# EAGLE design Display (EAGLE 7.3.0)
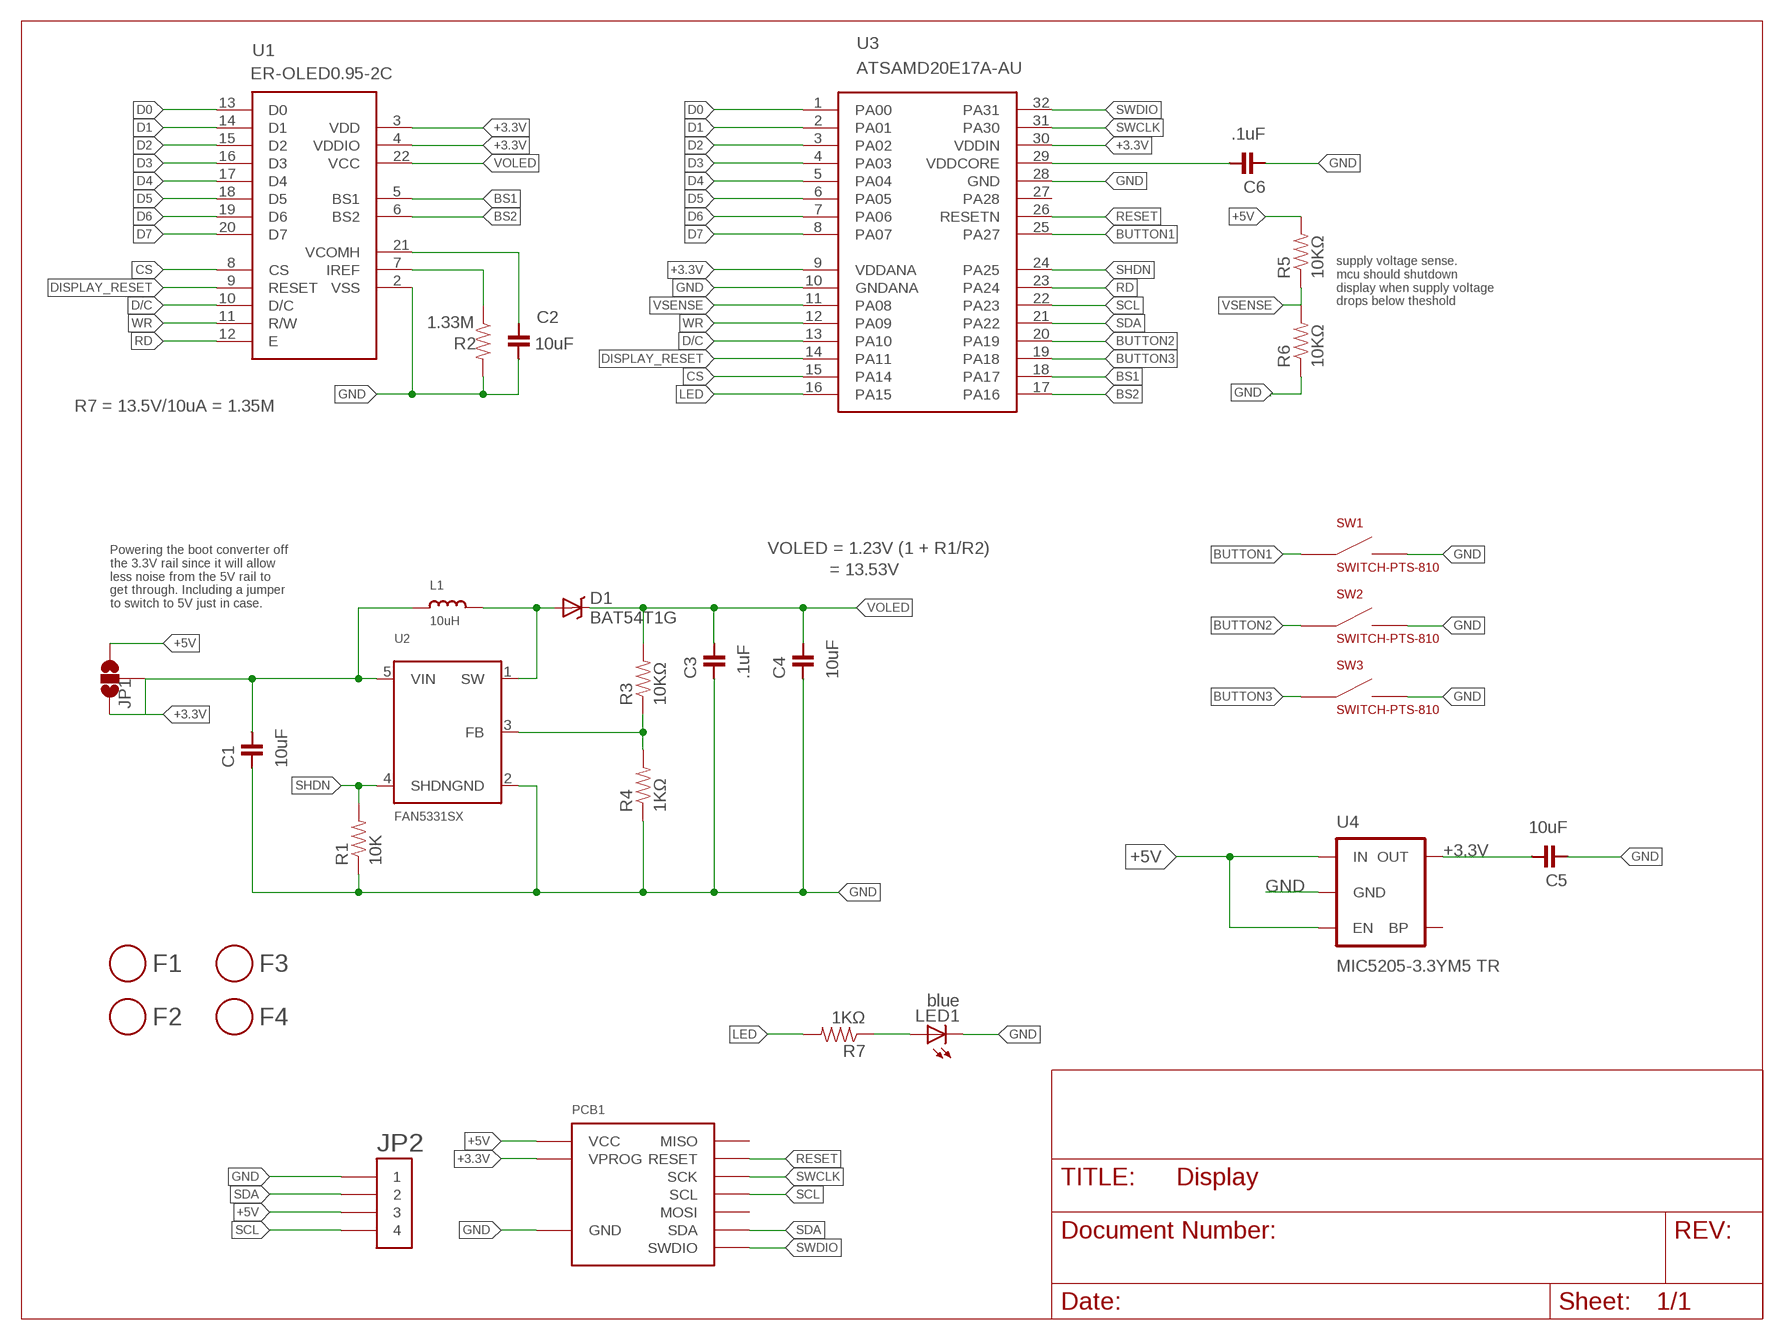
[diagram p0: schematic, sheet 1]
FRAME1 (LETTER_L): BOM: EXCLUDE

## Parts
C1  10uF  CAPACITOR-10UF  [0603]
C2  10uF  CAPACITOR-10UF  [0603]
C3  .1uF  CAPACITOR-.1UF  [0603]
C4  10uF  CAPACITOR-10UF  [0603]
C5  10uF  CAPACITOR-10UF  [0603]
C6  .1uF  CAPACITOR-.1UF  [0603]
D1  BAT54T1G  DIODE-SCHOTTKY  [SMP]
F1  FIDUCIAL  [FIDUCIAL_1MM]
F2  FIDUCIAL  [FIDUCIAL_1MM]
F3  FIDUCIAL  [FIDUCIAL_1MM]
F4  FIDUCIAL  [FIDUCIAL_1MM]
JP1  SOLDERJUMPER_2WAYS  [SJ_3]
JP2  HEADER-1X4-AMPMODU  [AMPMODU-4P]
L1  10uH  INDUCTOR  [INDUCTOR_1007]
LED1  blue  LED-0805-BLUE  [0805-LED]
PCB1  DEVICE-PCB  [DEVICE-PCB]
R1  10K  RESISTOR-10KΩ  [0603]
R2  1.33M  RESISTOR-0603  [0603]
R3  10KΩ  RESISTOR-10KΩ  [0603]
R4  1KΩ  RESISTOR-1KΩ  [0603]
R5  10KΩ  RESISTOR-10KΩ  [0603]
R6  10KΩ  RESISTOR-10KΩ  [0603]
R7  1KΩ  RESISTOR-1KΩ  [0603]
SW1  SWITCH-PTS-810  [TACT-SWITCH-PTS-810]
SW2  SWITCH-PTS-810  [TACT-SWITCH-PTS-810]
SW3  SWITCH-PTS-810  [TACT-SWITCH-PTS-810]
U1  ER-OLED0.95-2C  OLED-COLORREVERSE  [FPC-24-REVERSE]
U2  FAN5331SX  FAN5331  [SOT23-5]
U3  ATSAMD20E17A-AU  SAMD21E  [TQFP-32]
U4  MIC5205-3.3YM5 TR  VREG-MIC5205-3.3V  [SOT23-5]

## Nets
+3.3V: C1.1 C5.1 JP1.1 JP1.2 L1.P$1 PCB1.VPROG U1.3(VDD) U1.4(VDDIO) U2.5(VIN) U3.9(VDDANA) U3.30(VDDIN) U4.5(OUT)
+5V: JP1.3 JP2.P$5 JP2.P$6 PCB1.VCC R5.2 U4.1(IN) U4.3(EN)
BS1: U1.5(BS1) U3.18(PA17)
BS2: U1.6(BS2) U3.17(PA16)
BUTTON1: SW1.P$1(POS1) SW1.P$2(POS1) U3.25(PA27)
BUTTON2: SW2.P$1(POS1) SW2.P$2(POS1) U3.20(PA19)
BUTTON3: SW3.P$1(POS1) SW3.P$2(POS1) U3.19(PA18)
CS: U1.8(CS) U3.15(PA14)
D0: U1.13(D0) U3.1(PA00)
D1: U1.14(D1) U3.2(PA01)
D2: U1.15(D2) U3.3(PA02)
D3: U1.16(D3) U3.4(PA03)
D4: U1.17(D4) U3.5(PA04)
D5: U1.18(D5) U3.6(PA05)
D6: U1.19(D6) U3.7(PA06)
D7: U1.20(D7) U3.8(PA07)
D/C: U1.10(D/C) U3.13(PA10)
DISPLAY_RESET: U1.9(RESET) U3.14(PA11)
GND: C1.2 C2.2 C3.2 C4.2 C5.2 C6.2 JP2.P$1 JP2.P$2 LED1.C PCB1.GND R1.1 R2.2 R4.1 R6.1 SW1.P$3(NEG1) SW1.P$4(NEG1) SW2.P$3(NEG1) SW2.P$4(NEG1) SW3.P$3(NEG1) SW3.P$4(NEG1) U1.2(VSS) U2.2(GND) U3.10(GNDANA) U3.28(GND) U4.2(GND)
LED: R7.2 U3.16(PA15)
N$2: D1.A L1.P$2 U2.1(SW)
N$3: R3.1 R4.2 U2.3(FB)
N$4: C6.1 U3.29(VDDCORE)
N$5: C2.1 U1.21(VCOMH)
N$6: LED1.A R7.1
N$8: R2.1 U1.7(IREF)
RD: U1.12(E) U3.23(PA24)
RESET: PCB1.RESET U3.26(RESETN)
SCL: JP2.P$7 JP2.P$8 PCB1.SCL U3.22(PA23)
SDA: JP2.P$3 JP2.P$4 PCB1.SDA U3.21(PA22)
SHDN: R1.2 U2.4(SHDN) U3.24(PA25)
SWCLK: PCB1.CLK(SCK) U3.31(PA30)
SWDIO: PCB1.SWDIO U3.32(PA31)
VOLED: C3.1 C4.1 D1.C R3.2 U1.22(VCC)
VSENSE: R5.1 R6.2 U3.11(PA08)
WR: U1.11(R/W) U3.12(PA09)
Unconnected: PCB1.MISO PCB1.MOSI U3.27(PA28) U4.4(BP)

## Notes on the sheet
- supply voltage sense.
  mcu should shutdown
  display when supply voltage
  drops below theshold
- R7 = 13.5V/10uA = 1.35M
- VOLED = 1.23V (1 + R1/R2)
- = 13.53V
- Powering the boot converter off
  the 3.3V rail since it will allow
  less noise from the 5V rail to
  get through. Including a jumper
  to switch to 5V just in case.

## Library data of the parts
C1 C2 C4 C5 = Modulo:CAPACITOR: Capacitor; PARTNUM: GRM188R61C106MA73D
C3 C6 = Modulo:CAPACITOR: Capacitor; PARTNUM: C0603C104K5RACTU
D1 = Modulo:DIODE-SCHOTTKY; PARTNUM: SS3P3-M3/84A
F1-F4 = Modulo:FIDUCIAL; BOM: EXCLUDE
JP1 = SparkFun-Passives:SOLDERJUMPER_2WAY: Solder Jumper 2 way solder jumper; BOM: EXCLUDE
JP2 = Modulo:HEADER-1X4; PARTNUM: 147721-3
L1 = microbuilder:INDUCTOR: Inductors 0603: 10nH Ceramic Inductor - microwire antenna/RF (Digikey: 712-1434-2-ND) 0805: 560nH Ceramic Inductor - RF (Digikey: 553-1047-1-ND) 270nH Ceramic Inductor - Q = 40@250MHz, +-5%, 1 Ohm DC Resistance (Digikey: 535-10506-2-ND) 1007 (2518 Metric) SMT: 10µH 10% 250mOhm 820mA 1007 Inductor (Digikey: 587-2189-1-ND) 22µH 10% 500mOhm 580mA 1007 Inductor (Digikey: 587-2190-1-ND) 47µH 10% 950mOhm 420mA 1007 Inductor (Digikey: 587-2191-1-ND) 47µH 5% 100mOhm 1A 1008 Inductor (Digikey: 732-1816-1-ND) 5.0x5.0mm (Taiyo Yuden NR5040 Series) 6.8µH 20% 2.3A 64mOhm Inductor (Digikey: 587-2374-2-ND) 5.0x5.0mm (TDK VLC5045 Series) 4.7µH 20% 3.3A 34mOhm Inductor (Digikey: 445-6526-1-ND) 6.8µH 20% 2.7A 46mOhm Inductor (Digikey: 445-6527-1-ND) 6.0x6.0mm (TDK VLC6045 Series) 4.7µH 20% 3.8A 27mOhm Inductor (Digikey: 445-6538-2-ND) 6.8µH 20% 3A 41mOhm Inductor (Digikey: 445-6540-1-ND) 6.2µH 30% 2.2A 45mOhm Inductor (Digikey: SRR5028-6R2YCT-ND) - Not TDK VLC6045 but footprint should match 6.0x6.0mm (TDK SLF6045 Series) 6.8uH 30% 2A 33mOhm Inductor (Digikey: 445-4572-1-ND, Mouser: 810-SLF645T6R8N2R0PF) 6.0x6.0mm (Sumida CDRH5D28 Series) 6.2uH 30% 1.8A 45mOhm Inductor (Digikey: 308-1542-1-ND) Taiyo Yuden NR3015T2R2M - 2.2uH 20% 1.5A (Digikey: 587-1648-2-ND, Mouser: 963-NR3015T2R2M) - Used with TI TPS62172 CoilCraft RFID Transponder Coil - MA5532-AE (For use with AS3935 Lightning Sensor); PARTNUM: MPI2520R1-100-R
LED1 = Modulo:LED: LED; PARTNUM: LTST-C171TBKT
PCB1 = Modulo:DEVICE-PCB: Modulo Footprint; BOARD: Display; PARTNUM: Display PCB; VERSION: 4
R1 = Modulo:RESISTOR: Resistor Basic schematic elements and footprints for 0603, 1206, and PTH resistors.; PARTNUM: ERJ-3EKF1002V; VALUE: 10KΩ
R2 = Modulo:RESISTOR: Resistor Basic schematic elements and footprints for 0603, 1206, and PTH resistors.; PARTNUM: ERJ-3EKF1304V
R3 R5 R6 = Modulo:RESISTOR: Resistor Basic schematic elements and footprints for 0603, 1206, and PTH resistors.; PARTNUM: ERJ-3EKF1002V
R4 R7 = Modulo:RESISTOR: Resistor Basic schematic elements and footprints for 0603, 1206, and PTH resistors.; PARTNUM: ERJ-3EKF1001V
SW1-SW3 = Modulo:SWITCH; PARTNUM: PTS810 SJM 250 SMTR LFS
U1 = Modulo:OLED-COLOR; MANUFACTURER: buydisplay.com; PARTNUM: ER-OLED0.95-2C; SUPPLIER: buydisplay.com
U2 = microbuilder:FAN5331: FAN5331 - LED/OLED 20V Boost Converter Digikey: FAN5331SXCT-ND; PARTNUM: FAN5331SX
U3 = Modulo:SAMD21E; PARTNUM: ATSAMD20E17A-AU; VALUE: ATSAMD21E18A-AU
U4 = Modulo:VREG-MIC5205: V_REG MIC5219 Standard 3.3V and 5V 150mA LDO voltage regulator in SOT-23 layout. Micrel part MIC5205. BP (by-pass) pin is used to lower output noise with 470pF cap, may be left open.; PARTNUM: MIC5205-3.3YM5 TR

## Board
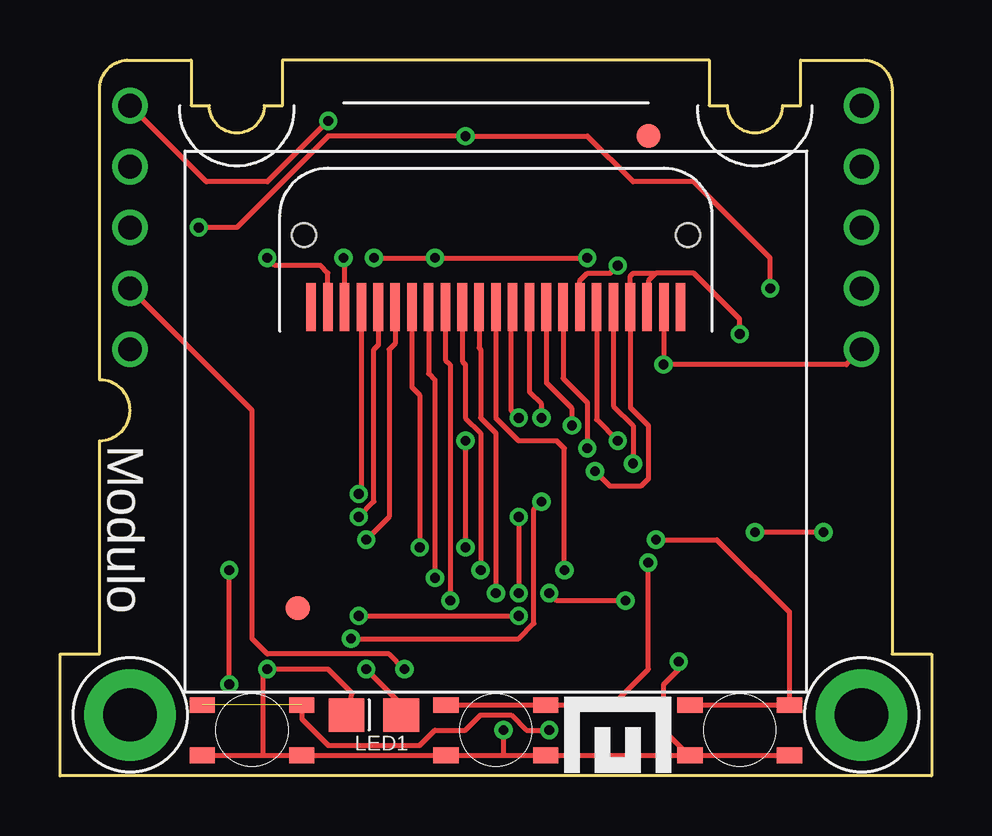
[diagram p1: board, top side]
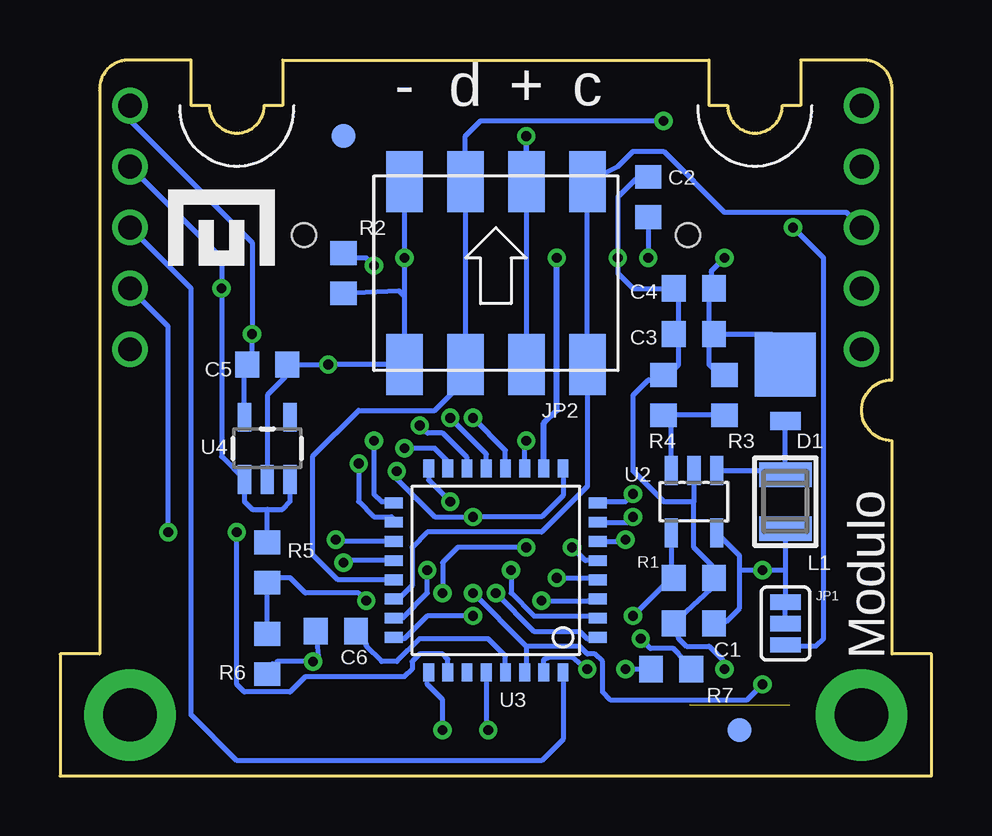
[diagram p2: board, bottom side, seen from below]

Size 36.32 x 29.84 mm. Coordinates in mm from the lower left corner, seen from the top.
Copper layers (1*16): Top 0.0356mm / dielectric 1.5011mm / Bottom 0.0356mm
Design rules "Modulo": minimum track width 6mil, minimum drill 13mil, track to track 6mil, track to pad 6mil, pad to pad 6mil, via to via 6mil, smd to smd 6mil, copper to edge 15mil, drill to drill 6mil, minimum pad ring 7mil, minimum via ring 7mil, stop-mask expansion 3mil, vias tented up to drill 25mil, thermal gap 10mil

### Footprints (pad centres in the part's own frame; a part is rotated, then mirrored left to right if it is on the bottom)
0603 = smd 0.991 x 1.092: 1 -0.838,0; 2 0.838,0
SMP = smd 0.762 x 1.27: A 2.349,0 | smd 2.667 x 2.54: C 0,0
FIDUCIAL_1MM = smd 1 x 1: 1 0,0
SJ_3 = smd 0.635 x 1.27: 1 -0.889,0; 2 0,0; 3 0.889,0
AMPMODU-4P = smd 1.524 x 2.54: P$1 -3.81,3.81; P$2 -3.81,-3.81; P$3 -1.27,3.81; P$4 -1.27,-3.81; P$5 1.27,3.81; P$6 1.27,-3.81; P$7 3.81,3.81; P$8 3.81,-3.81
INDUCTOR_1007 = smd 1.016 x 2.2: P$1 -1.127,0; P$2 1.127,0
0805-LED = smd 1.397 x 1.499: A 0,-1.143; C 0,1.143
DEVICE-PCB = drill 0.991: CLK 2.54,20.32; GND 33.02,17.78; MISO 2.54,17.78; MOSI 2.54,25.4; RESET 33.02,20.32; SCL 2.54,22.86; SDA 2.54,27.94; SWDIO 33.02,22.86; VCC 33.02,25.4; VPROG 33.02,27.94 | drill 2.223 pad 3.81: P$1 2.54,2.54; P$2 33.02,2.54
TACT-SWITCH-PTS-810 = smd 1.05 x 0.65: P$1 -2.075,1.05; P$2 2.075,1.05; P$3 -2.075,-1.05; P$4 2.075,-1.05
FPC-24-REVERSE = smd 0.4 x 2: 1 7.7,1; 2 7,1; 3 6.3,1; 4 5.6,1; 5 4.9,1; 6 4.2,1; 7 3.5,1; 8 2.8,1; 9 2.1,1; 10 1.4,1; 11 0.7,1; 12 0,1; 13 -0.7,1; 14 -1.4,1; 15 -2.1,1; 16 -2.8,1; 17 -3.5,1; 18 -4.2,1; 19 -4.9,1; 20 -5.6,1; 21 -6.3,1; 22 -7,1; 23 -7.7,1 | hole 1: -8,4; 8.001,4
SOT23-5 = smd 0.55 x 1.2: 1 -0.95,-1.3; 2 0,-1.3; 3 0.95,-1.3; 4 0.95,1.3; 5 -0.95,1.3
TQFP-32 = smd 0.75 x 0.45: 1 -4.25,2.8; 2 -4.25,2; 3 -4.25,1.2; 4 -4.25,0.4; 5 -4.25,-0.4; 6 -4.25,-1.2; 7 -4.25,-2; 8 -4.25,-2.8; 17 4.25,-2.8; 18 4.25,-2; 19 4.25,-1.2; 20 4.25,-0.4; 21 4.25,0.4; 22 4.25,1.2; 23 4.25,2; 24 4.25,2.8 | smd 0.45 x 0.75: 9 -2.8,-4.25; 10 -2,-4.25; 11 -1.2,-4.25; 12 -0.4,-4.25; 13 0.4,-4.25; 14 1.2,-4.25; 15 2,-4.25; 16 2.8,-4.25; 25 2.8,4.25; 26 2,4.25; 27 1.2,4.25; 28 0.4,4.25; 29 -0.4,4.25; 30 -1.2,4.25; 31 -2,4.25; 32 -2.8,4.25

### Placement (x,y rotation side)
C1  9.91,6.35 180 bottom
C2  11.81,24.13 90 bottom
C3  9.91,18.41 180 bottom
C4  9.91,20.32 180 bottom
C5  27.69,17.14 0 bottom
C6  24.83,6.03 180 bottom
D1  6.1,17.14 270 bottom
F1  9.91,6.99 0 top
F2  24.51,26.67 0 top
F3  24.51,26.67 0 bottom
F4  8,1.91 0 bottom
JP1  6.1,6.35 270 bottom
JP2  18.16,20.95 0 bottom
L1  6.1,11.43 90 bottom
LED1  13.08,2.54 90 top
PCB1  0.38,0 0 top
R1  9.91,8.26 180 bottom
R2  24.51,20.95 270 bottom
R3  8.64,15.88 90 bottom
R4  11.18,15.88 270 bottom
R5  27.69,8.89 90 bottom
R6  27.69,5.08 90 bottom
R7  10.86,4.45 0 bottom
SW1  8,1.91 0 top
SW2  18.16,1.91 0 top
SW3  28.32,1.91 0 top
U1  18.16,18.54 0 top
U2  9.91,11.43 180 bottom
U3  18.16,8.57 180 bottom
U4  27.69,13.65 0 bottom
U$1  [LOGO-SMALL]  22.92,0.76 0 top
U$2  [LOGO-SMALL]  29.91,21.91 0 bottom

### Tracks (layer width: path | path; a pad name or v marks a point on that pad's centre or on a via)
+3.3V  (via drill 0.41)
  Top 0.203: v28.32,18.41 28.32,19.05 26.42,20.95 24.83,20.95 | 24.83,20.95 24.51,20.64 24.51,19.59 U1.3 | 24.83,20.95 23.88,20.95 23.76,20.84 U1.4 23.76,15.36 24.51,14.61 24.51,12.38 24.19,12.06 22.92,12.06 v22.29,12.7 | v19.11,10.79 v19.11,7.62 | v7.05,3.81 v7.05,8.57
  Bottom 0.203: U4.5 28.64,16.92 C5.1 28.32,17.14 v28.32,18.41 28.32,22.23 33.4,27.3 PCB1.VPROG | 16.89,5.4 v19.11,7.62 | v7.05,3.81 7.68,3.17 13.4,3.17 13.72,3.49 13.72,4.76 14.03,5.08 14.35,5.08 14.67,5.4 16.89,5.4 | U3.9 15.36,11.69 16.26,10.79 v19.11,10.79 20.7,10.79 22.29,12.38 v22.29,12.7 | 16.89,5.4 16.89,4.39 U3.30 | JP1.2 JP1.1 6.16,7.3 | 6.16,7.3 6.1,7.3 6.1,8.57 | 6.16,7.3 6.41,7.3 6.55,7.16 | L1.P$1 6.1,8.57 | 6.1,8.57 v7.05,8.57 8,8.57 | C1.1 9.18,6.44 8.55,6.44 8,6.99 8,8.57 | 8,8.57 8,9.18 U2.5
+5V  (via drill 0.41)
  Top 0.203: v5.78,22.86 7.37,22.86 11.18,26.67 v16.89,26.67 21.97,26.67 23.88,24.77 26.42,24.77 29.59,21.59 v29.59,20.32
  Bottom 0.203: JP2.P$5 v16.89,26.67 JP2.P$6 | 27.69,11.11 28.32,11.11 28.64,11.43 U4.1 29.59,13.31 v29.59,20.32 29.59,21.59 PCB1.VCC | 27.69,11.11 27.05,11.11 26.73,11.43 U4.3 | R5.2 27.69,11.11 | 5.64,5.54 JP1.3 6.03,5.4 4.83,5.4 4.51,5.71 4.51,21.59 v5.78,22.86
BS1  (via drill 0.41)
  Top 0.203: U1.5 23.06,15.42 23.88,14.61 v23.88,13.02
  Bottom 0.203: v23.88,13.02 23.88,11.43 23.24,10.79 22.51,10.79 U3.18
BS2  (via drill 0.41)
  Top 0.203: U1.6 22.36,14.85 v23.24,13.97
  Bottom 0.203: v23.24,13.97 23.24,11.75 22.92,11.43 22.47,11.43 U3.17
BUTTON1  (via drill 0.41)  (1 unrouted)
  Top 0.203: SW1.P$2 10.08,2.37 11.18,1.27 14.99,1.27 15.62,1.91 16.89,1.91 17.53,2.54 18.8,2.54 19.43,1.91 v20.38,1.91
  Bottom 0.203: v20.38,1.91 20.38,3.17 21.02,3.81 21.02,4.26 U3.25 20.84,4.13
BUTTON2  (via drill 0.41)
  Top 0.203: v24.51,8.89 24.51,4.45 23.02,2.96 SW2.P$2 SW2.P$1
  Bottom 0.203: U3.20 24.43,8.97 v24.51,8.89
BUTTON3  (via drill 0.41)
  Top 0.203: v24.83,9.84 27.37,9.84 30.4,6.82 SW3.P$2 SW3.P$1
  Bottom 0.203: U3.19 24.58,9.77 v24.83,9.84
CS  (via drill 0.41)
  Top 0.203: U1.8 20.96,16.57 21.97,15.56 v21.97,13.65
  Bottom 0.203: U3.15 20.16,13.11 20.7,13.65 v21.97,13.65
D0  (via drill 0.41)
  Top 0.203: U1.13 17.46,17.84 17.53,17.78 17.53,14.92 18.16,14.29 v18.16,7.62
  Bottom 0.203: v18.16,7.62 16.57,6.03 14.67,6.03 14.35,5.71 13.97,5.71 U3.1
D1  (via drill 0.41)
  Top 0.203: U1.14 16.76,17.27 16.89,17.14 16.89,14.92 17.53,14.29 v17.53,8.57
  Bottom 0.203: v17.53,8.57 17.53,7.62 16.57,6.67 14.32,6.67 U3.2
D2  (via drill 0.41)
  Top 0.203: U1.15 16.06,17.34 16.26,17.14 v16.26,7.3
  Bottom 0.203: v16.26,7.3 14.3,7.3 U3.3
D3  (via drill 0.41)
  Top 0.203: U1.16 15.36,16.77 15.62,16.51 v15.62,8.26
  Bottom 0.203: v15.62,8.26 14.15,8.26 U3.4
D4  (via drill 0.41)
  Top 0.203: U1.17 14.66,16.2 14.99,15.88 v14.99,9.53
  Bottom 0.203: U3.5 14.43,8.97 v14.99,9.53
D5  (via drill 0.41)
  Top 0.203: U1.18 13.96,18.02 13.72,17.78 13.72,10.79 v12.76,9.84
  Bottom 0.203: U3.6 12.83,9.77 v12.76,9.84
D6  (via drill 0.41)
  Top 0.203: v12.45,10.79 13.08,11.43 13.08,17.78 13.26,17.96 U1.19
  Bottom 0.203: U3.7 12.67,10.57 v12.45,10.79
D7  (via drill 0.41)
  Top 0.203: U1.20 12.56,11.86 v12.45,11.75
  Bottom 0.203: U3.8 13.77,11.37 13.72,11.43 12.76,11.43 v12.45,11.75
D/C  (via drill 0.41)
  Top 0.203: U1.10 19.56,16 20.07,15.5 v20.07,14.92
  Bottom 0.203: U3.13 18.56,13.42 v20.07,14.92
DISPLAY_RESET  (via drill 0.41)
  Top 0.203: U1.9 20.26,16.39 21.34,15.31 v21.34,14.61
  Bottom 0.203: U3.14 19.36,13.27 20.38,14.29 21.02,14.29 v21.34,14.61
GND  (via drill 0.41)
  Top 0.203: U1.2 25.16,17.16 v25.15,17.14 32.77,17.14 PCB1.GND | v13.08,21.59 v15.62,21.59 v21.97,21.59 | SW1.P$3 8.47,0.85 | 8.47,0.85 SW1.P$4 SW2.P$3 18.48,0.85 | 18.48,0.85 SW2.P$4 SW3.P$3 | SW3.P$3 SW3.P$4 | SW3.P$3 26.2,0.85 25.15,1.91 25.15,3.81 25.78,4.45 v25.78,4.76 | v18.48,1.91 18.48,0.85 | 8.47,0.85 8.47,4.28 v8.64,4.45 11.18,4.45 12.18,3.44 LED1.C
  Bottom 0.203: U2.2 9.91,11.43 | 9.91,11.43 9.91,9.53 9.18,8.8 R1.1 9.18,7.8 C1.2 10.54,5.71 10.22,5.4 9.27,5.4 8.73,4.85 8.73,4.54 v8.64,4.45 | 9.91,11.43 11.18,11.43 12.45,12.7 12.45,15.88 11.81,16.51 11.27,16.51 R4.1 11.09,16.6 10.54,17.14 10.54,18.32 C3.2 10.54,18.41 10.54,20.23 C4.2 12.45,20.32 13.08,20.95 v13.08,21.59 13.08,24.13 12.36,24.86 C2.2 | JP2.P$1 v21.97,21.59 21.97,20 | 21.97,20 JP2.P$2 v25.15,17.14 C5.2 26.96,16.6 27.69,15.88 U4.2 | 27.46,4.67 R6.1 27.28,4.76 v25.78,4.76 25.55,4.99 C6.2 | R2.2 22.2,20.23 21.97,20 | U3.28 18.56,1.99 v18.48,1.91
  Bottom 0.254: U3.10 16.16,14.7 15.62,15.24 v15.62,21.59
LED  (via drill 0.41)
  Top 0.203: v12.13,5.71 19.11,5.71 19.75,6.35 19.75,11.11 v20.07,11.43
  Bottom 0.203: R7.2 10.54,5.08 10.77,5.31 11.72,5.31 v12.13,5.71 | U3.16 20.96,12.32 v20.07,11.43
N$2
  Bottom 0.203: U2.1 6.27,12.73 L1.P$2 D1.A
N$3
  Bottom 0.203: U2.3 10.86,14.83 R4.2 R3.1
N$4
  Bottom 0.203: U3.29 17.76,5 18.48,5.71 21.34,5.71 22.29,4.76 22.92,4.76 23.56,5.4 23.56,5.49 C6.1
N$5  (via drill 0.41)
  Top 0.203: U1.21 11.86,21.54 v11.81,21.59
  Bottom 0.203: C2.1 v11.81,21.59
N$6  (via drill 0.41)
  Top 0.203: v12.76,4.45 14.03,3.17 14.03,2.59 LED1.A
  Bottom 0.203: R7.1 v12.76,4.45
N$8  (via drill 0.41)
  Top 0.203: U1.7 21.66,20.64 21.97,20.95 22.92,20.95 v23.24,21.27
  Bottom 0.203: v23.24,21.27 23.56,21.59 24.42,21.59 R2.1
RD  (via drill 0.41)
  Top 0.203: U1.12 18.16,14.92 19.11,13.97 20.7,13.97 21.02,13.65 v21.02,8.57
  Bottom 0.203: U3.23 22.07,6.57 21.02,7.62 v21.02,8.57
RESET  (via drill 0.41)
  Top 0.203: v28.96,10.16 v31.81,10.16
  Bottom 0.203: v28.96,10.16 28.96,3.81 28.64,3.49 26.73,3.49 26.1,4.13 21.97,4.13 21.65,4.45 21.65,4.76 21.34,5.08 20.38,5.08 20.16,4.86 U3.26 | v31.81,10.16 31.81,18.73 PCB1.RESET
SCL
  Bottom 0.203: PCB1.SCL 3.56,23.5 8.64,23.5 11.18,26.04 12.45,26.04 13.08,25.4 JP2.P$7 JP2.P$8 14.35,12.06 16.26,10.16 21.02,10.16 21.65,9.53 21.65,7.94 22.29,7.3 22.34,7.3 U3.22
SDA  (via drill 0.41)
  Top 0.203: v11.18,27.3 8.64,24.77 6.1,24.77 PCB1.SDA
  Bottom 0.203: v11.18,27.3 18.8,27.3 19.43,26.67 JP2.P$3 JP2.P$4 19.43,16.51 20.7,15.24 23.88,15.24 25.78,13.34 25.78,9.21 24.75,8.17 U3.21
SHDN  (via drill 0.41)
  Top 0.203: v12.45,6.67 v19.11,6.67
  Bottom 0.203: U2.4 10.86,8.48 | 10.86,8.48 R1.2 | 10.86,8.48 10.86,7.94 11.18,7.94 v12.45,6.67 | v19.11,6.67 21.02,6.67 21.97,5.71 22.35,5.71 U3.24
SWCLK  (via drill 0.41)
  Top 0.203: v14.35,4.45 13.72,5.08 8.64,5.08 8,5.71 8,15.24 PCB1.CLK
  Bottom 0.203: U3.31 16.16,4.86 15.94,4.95 14.99,4.95 v14.35,4.45
SWDIO
  Bottom 0.203: U3.32 15.36,1.53 16.26,0.64 28.96,0.64 30.86,2.54 30.86,20.32 PCB1.SWDIO
VOLED  (via drill 0.41)
  Top 0.203: U1.22 11.16,20.97 10.86,21.27 8.95,21.27 v8.64,21.59
  Bottom 0.203: R3.2 8.73,16.6 9.27,17.14 9.27,18.32 C3.1 | C3.1 9.27,18.41 9.27,20.23 C4.1 9.18,21.05 v8.64,21.59 | C3.1 6.68,18.41 D1.C
VSENSE  (via drill 0.41)
  Top 0.203: v16.89,13.97 v16.89,9.53 | v23.56,7.3 20.7,7.3 v20.38,7.62
  Bottom 0.203: 27.6,5.71 R6.2 R5.1 27.6,8.26 26.73,8.26 26.1,7.62 23.88,7.62 v23.56,7.3 | U3.11 16.96,13.9 v16.89,13.97 | v16.89,9.53 19.75,9.53 20.38,8.89 v20.38,7.62
WR  (via drill 0.41)
  Top 0.203: v19.11,14.92 18.8,15.24 18.8,19.48
  Top 0.254: 18.8,19.48 U1.11
  Bottom 0.203: U3.12 17.76,13.57 v19.11,14.92